# EAGLE design agitator (EAGLE 9.6.2)
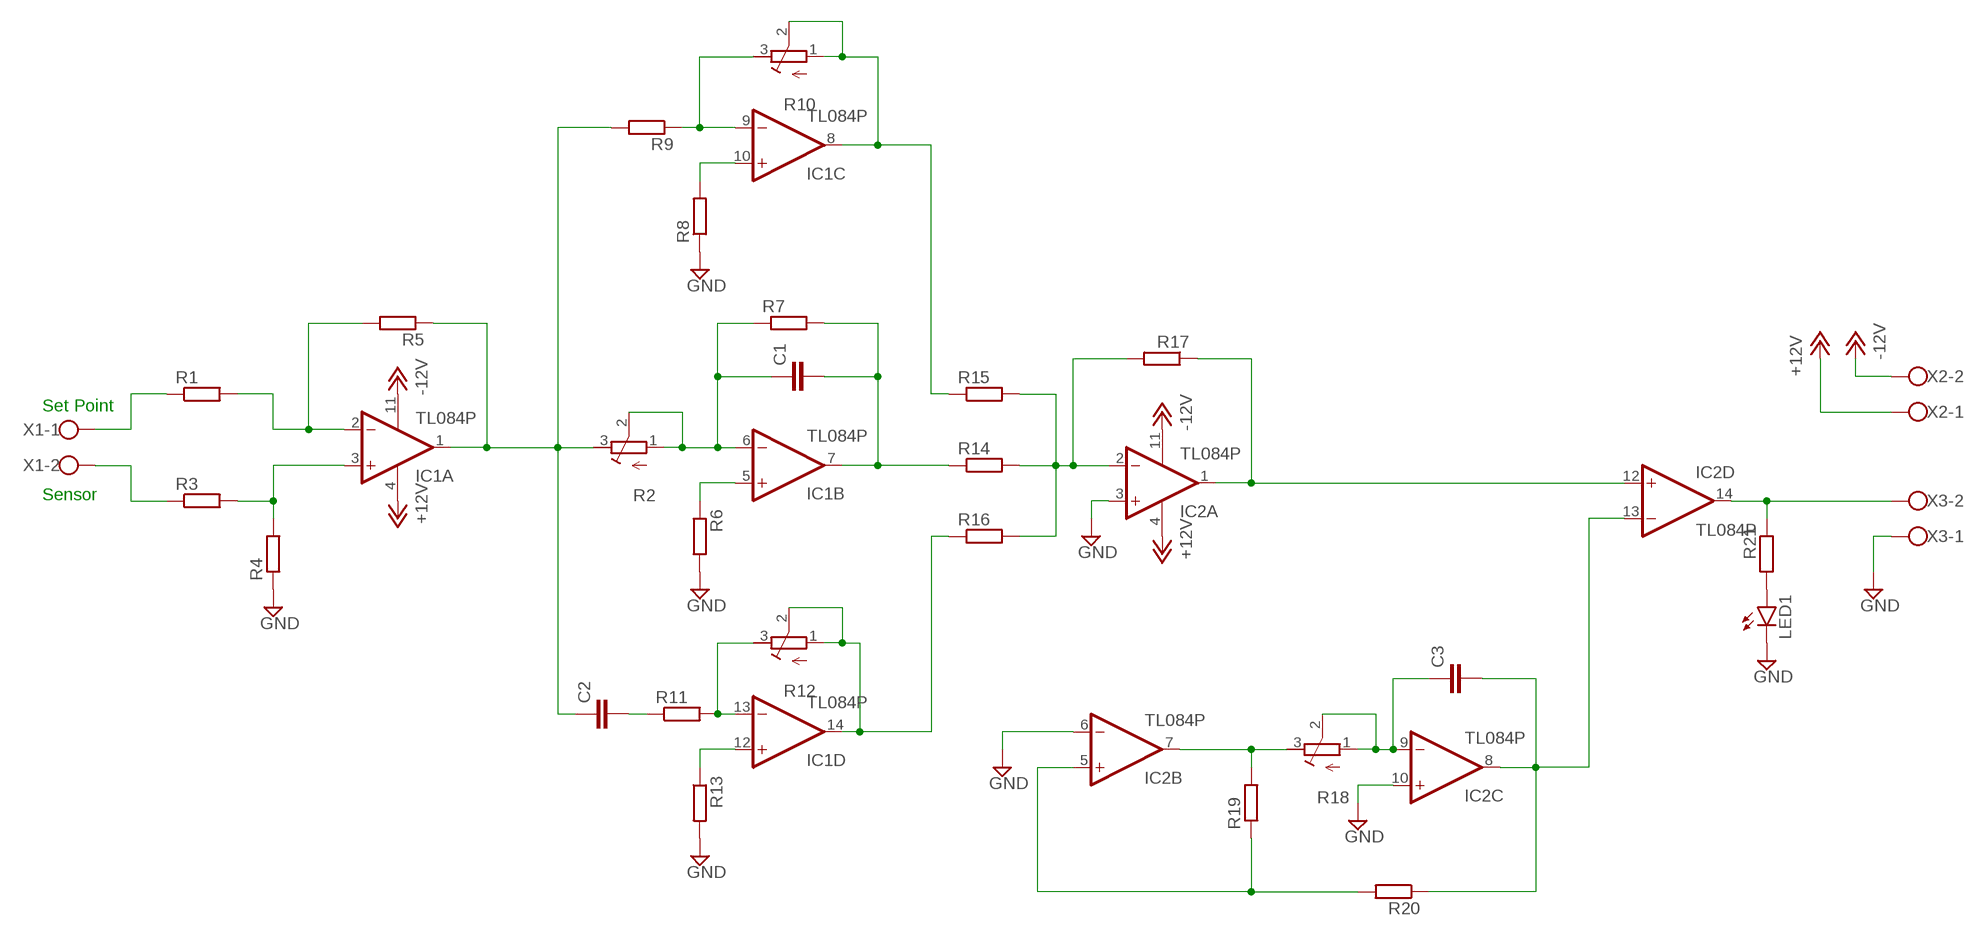
[diagram p0: schematic, sheet 1]

## Parts
C1  C2.5/2  [C2.5-2]
C2  C2.5/2  [C2.5-2]
C3  C2.5/2  [C2.5-2]
IC1  TL084P  [DIL14]
IC2  TL084P  [DIL14]
LED1  LED3MM  [LED3MM]
R1  R-EU_0207/10  [0207/10]
R2  R-TRIMM64W  [RTRIM64W]
R3  R-EU_0207/10  [0207/10]
R4  R-EU_0207/10  [0207/10]
R5  R-EU_0207/10  [0207/10]
R6  R-EU_0207/10  [0207/10]
R7  R-EU_0207/10  [0207/10]
R8  R-EU_0207/10  [0207/10]
R9  R-EU_0207/10  [0207/10]
R10  R-TRIMM64W  [RTRIM64W]
R11  R-EU_0207/10  [0207/10]
R12  R-TRIMM64W  [RTRIM64W]
R13  R-EU_0207/10  [0207/10]
R14  R-EU_0207/10  [0207/10]
R15  R-EU_0207/10  [0207/10]
R16  R-EU_0207/10  [0207/10]
R17  R-EU_0207/10  [0207/10]
R18  R-TRIMM64W  [RTRIM64W]
R19  R-EU_0207/10  [0207/10]
R20  R-EU_0207/10  [0207/10]
R21  R-EU_0207/10  [0207/10]
X1  W237-102  [W237-102]
X2  W237-102  [W237-102]
X3  W237-102  [W237-102]

## Nets
+12V: IC1.4(P:V+) IC2.4(P:V+) X2.1
-12V: IC1.11(P:V-) IC2.11(P:V-) X2.2
GND: IC2.3(A:+IN) IC2.6(B:-IN) IC2.10(C:+IN) LED1.K(C) R4.1 R6.2 R8.1 R13.2 X3.1
N$1: IC1.3(A:+IN) R3.2 R4.2
N$2: IC1.2(A:-IN) R1.2 R5.2
N$3: C2.1 IC1.1(A:OUT) R2.3(E) R5.1 R9.2
N$4: R1.1 X1.1
N$5: R3.1 X1.2
N$6: C1.1 IC1.6(B:-IN) R2.1(A) R2.2(S) R7.1
N$7: C1.2 IC1.7(B:OUT) R7.2 R14.1
N$8: IC1.5(B:+IN) R6.1
N$9: IC1.10(C:+IN) R8.2
N$10: IC1.9(C:-IN) R9.1 R10.3(E)
N$11: C2.2 R11.1
N$12: IC1.8(C:OUT) R10.1(A) R10.2(S) R15.1
N$13: IC1.13(D:-IN) R11.2 R12.3(E)
N$14: IC1.14(D:OUT) R12.1(A) R12.2(S) R16.1
N$15: IC1.12(D:+IN) R13.1
N$16: IC2.2(A:-IN) R14.2 R15.2 R16.2 R17.2
N$17: IC2.1(A:OUT) IC2.12(D:+IN) R17.1
N$18: IC2.7(B:OUT) R18.3(E) R19.2
N$19: C3.1 IC2.9(C:-IN) R18.1(A) R18.2(S)
N$20: LED1.A R21.2
N$21: IC2.5(B:+IN) R19.1 R20.2
N$22: C3.2 IC2.8(C:OUT) IC2.13(D:-IN) R20.1
N$23: IC2.14(D:OUT) R21.1 X3.2

## Notes on the sheet
- Set Point
- Sensor

## Library data of the parts
C1-C3 = capacitor-wima:C: CAPACITOR naming: grid - package width
IC1 IC2 = linear:TL084: OP AMP
LED1 = led:LED: LED OSRAM: - CHIPLED LG R971, LG N971, LY N971, LG Q971, LY Q971, LO R971, LY R971 LH N974, LH R974 LS Q976, LO Q976, LY Q976 LO Q996 - Hyper CHIPLED LW Q18S LB Q993, LB Q99A, LB R99A - SideLED LS A670, LO A670, LY A670, LG A670, LP A670 LB A673, LV A673, LT A673, LW A673 LH A674 LY A675 LS A676, LA A676, LO A676, LY A676, LW A676 LS A679, LY A679, LG A679 - Hyper Micro SIDELED® LS Y876, LA Y876, LO Y876, LY Y876 LT Y87S - SmartLED LW L88C, LW L88S LB L89C, LB L89S, LG L890 LS L89K, LO L89K, LY L89K LS L896, LA L896, LO L896, LY L896 - TOPLED LS T670, LO T670, LY T670, LG T670, LP T670 LSG T670, LSP T670, LSY T670, LOP T670, LYG T670 LG T671, LOG T671, LSG T671 LB T673, LV T673, LT T673, LW T673 LH T674 LS T676, LA T676, LO T676, LY T676, LB T676, LH T676, LSB T676, LW T676 LB T67C, LV T67C, LT T67C, LS T67K, LO T67K, LY T67K, LW E67C LS E67B, LA E67B, LO E67B, LY E67B, LB E67C, LV E67C, LT E67C LW T67C LS T679, LY T679, LG T679 LS T770, LO T770, LY T770, LG T770, LP T770 LB T773, LV T773, LT T773, LW T773 LH T774 LS E675, LA E675, LY E675, LS T675 LS T776, LA T776, LO T776, LY T776, LB T776 LHGB T686 LT T68C, LB T68C - Hyper Mini TOPLED® LB M676 - Mini TOPLED Santana® LG M470 LS M47K, LO M47K, LY M47K Source: http://www.osram.convergy.de LUXEON: - LUMILED® LXK2-PW12-R00, LXK2-PW12-S00, LXK2-PW14-U00, LXK2-PW14-V00 LXK2-PM12-R00, LXK2-PM12-S00, LXK2-PM14-U00 LXK2-PE12-Q00, LXK2-PE12-R00, LXK2-PE12-S00, LXK2-PE14-T00, LXK2-PE14-U00 LXK2-PB12-K00, LXK2-PB12-L00, LXK2-PB12-M00, LXK2-PB14-N00, LXK2-PB14-P00, LXK2-PB14-Q00 LXK2-PR12-L00, LXK2-PR12-M00, LXK2-PR14-Q00, LXK2-PR14-R00 LXK2-PD12-Q00, LXK2-PD12-R00, LXK2-PD12-S00 LXK2-PH12-R00, LXK2-PH12-S00 LXK2-PL12-P00, LXK2-PL12-Q00, LXK2-PL12-R00 Source: www.luxeon.com KINGBRIGHT: KA-3528ASYC Source: www.kingbright.com
R1 R3-R9 R11 R13-R17 R19-R21 = rcl:R-EU_: RESISTOR, European symbol; SPICEPREFIX: R
R2 R10 R12 R18 = rcl:R-TRIMM: Trimm resistor; SPICEMODEL: X; SPICEPREFIXL: POT
X1-X3 = con-wago-500:W237-102: WAGO SCREW CLAMP; MPN: 237-102; OC_FARNELL: unknown; OC_NEWARK: 70K9898

## Board
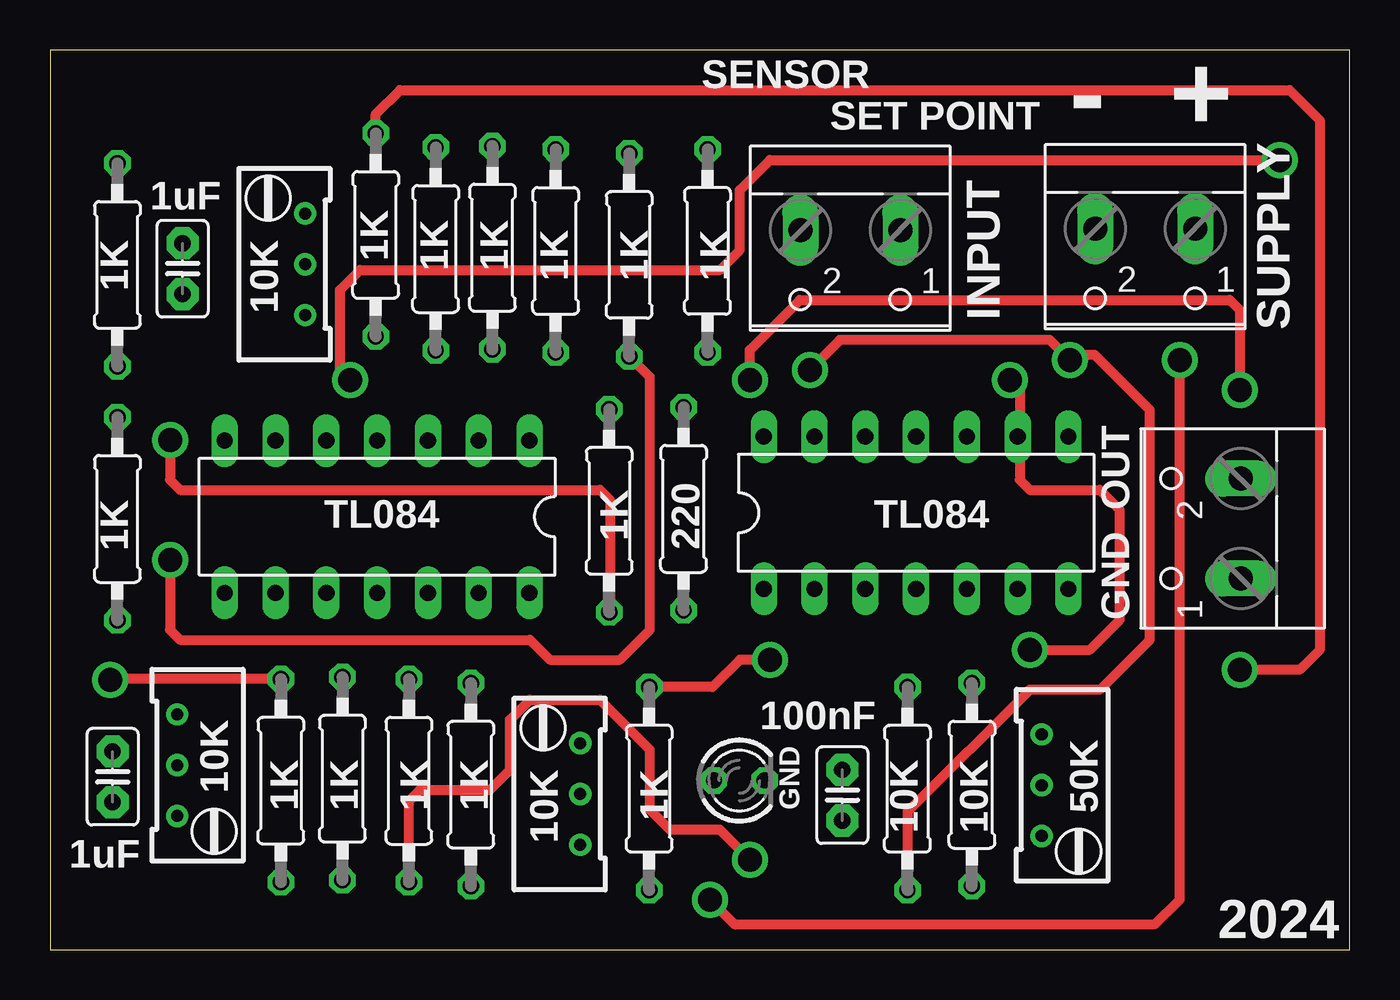
[diagram p1: board, top side]
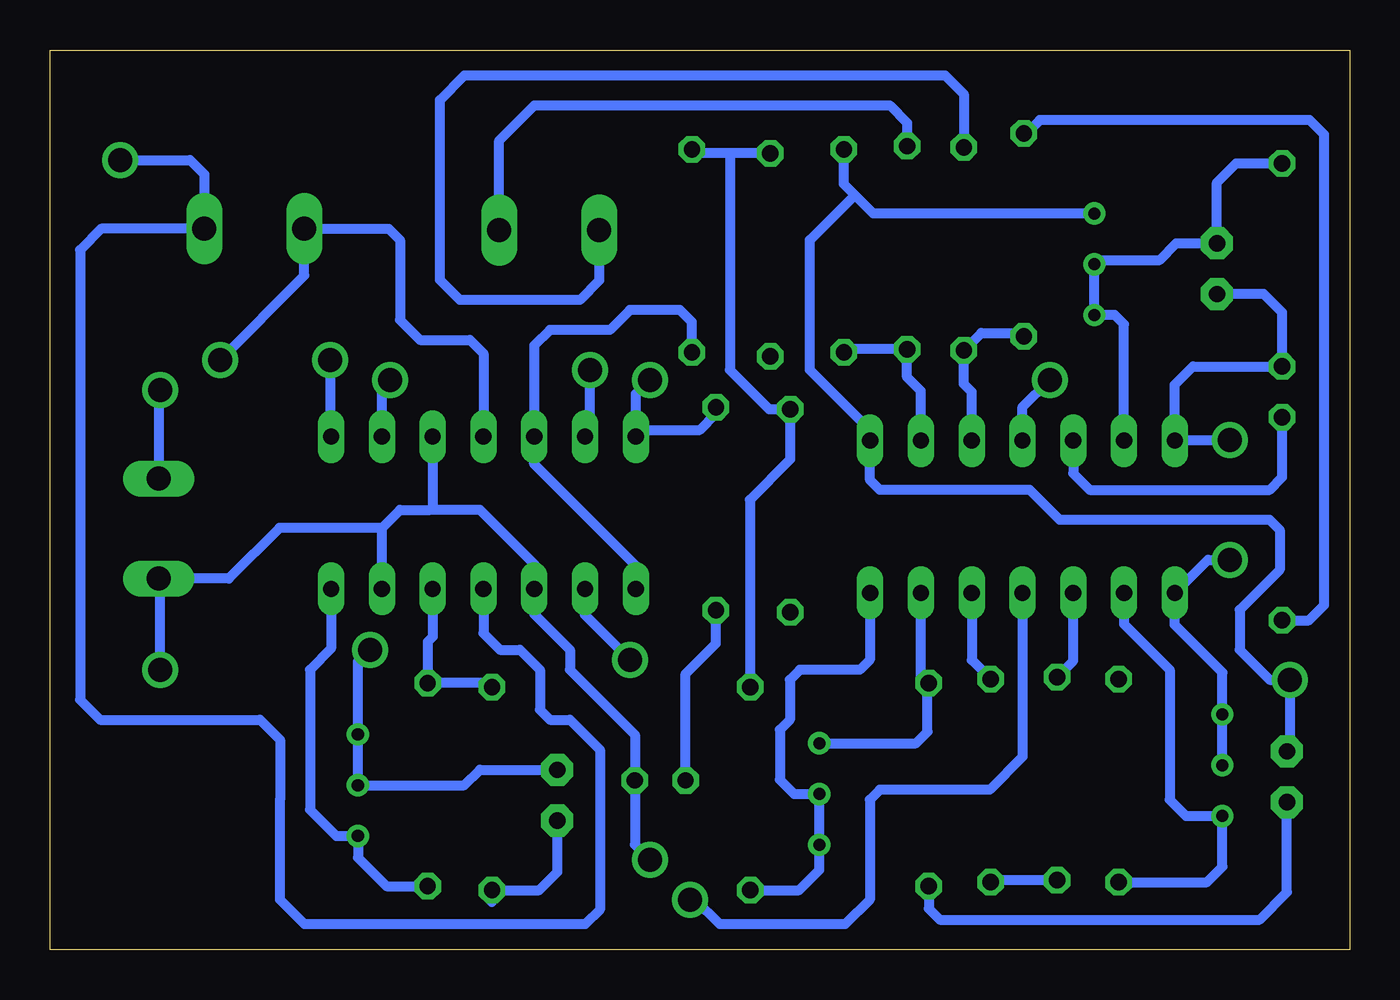
[diagram p2: board, bottom side, seen from below]

Size 65 x 45 mm. Coordinates in mm from the lower left corner, seen from the top.
Outline: 0,0 65,0 65,45 0,45 0,0
Copper layers (1*16): Top 0.035mm / dielectric 1.5mm / Bottom 0.035mm
Design rules "default": minimum track width 6mil, minimum drill 0.35mm, track to track 6mil, track to pad 6mil, pad to pad 6mil, via to via 6mil, smd to smd 6mil, copper to edge 40mil, drill to drill 6mil, minimum pad ring 10mil, minimum via ring 8mil, stop-mask expansion 4mil, vias tented up to drill 0mil, thermal gap 10mil

### Footprints (pad centres in the part's own frame; a part is rotated, then mirrored left to right if it is on the bottom)
C2.5-2 = drill 0.813 pad 1.6 octagon: 1 -1.27,0; 2 1.27,0
DIL14 = drill 0.813 long: 1 -7.62,-3.81; 2 -5.08,-3.81; 3 -2.54,-3.81; 4 0,-3.81; 5 2.54,-3.81; 6 5.08,-3.81; 7 7.62,-3.81; 8 7.62,3.81; 9 5.08,3.81; 10 2.54,3.81; 11 0,3.81; 12 -2.54,3.81; 13 -5.08,3.81; 14 -7.62,3.81
LED3MM = drill 0.813 octagon: A -1.27,0; K 1.27,0
0207/10 = drill 0.813 octagon: 1 -5.08,0; 2 5.08,0
RTRIM64W = drill 0.61: 1 1.27,-2.54; 2 1.27,0; 3 1.27,2.54
W237-102 = drill 1.194 long: 1 -2.5,-1.27; 2 2.5,-1.27

### Placement (x,y rotation side)
C1  6.63,34.06 270 top
C2  3.13,8.64 270 top
C3  39.63,7.72 270 top
IC1  16.36,21.65 180 top
IC2  43.32,21.85 0 top
LED1  34.48,8.46 0 top
R1  22.13,35.11 270 top
R2  11.49,34.28 0 top
R3  19.29,35.05 270 top
R4  16.29,35.75 270 top
R5  25.29,34.95 270 top
R6  3.37,21.55 270 top
R7  3.37,34.25 270 top
R8  14.63,8.55 90 top
R9  11.55,8.45 90 top
R10  7.63,9.22 180 top
R11  21.05,8.25 90 top
R12  25.25,7.78 0 top
R13  17.95,8.45 270 top
R14  27.97,21.95 90 top
R15  28.97,34.75 90 top
R16  29.97,8.05 90 top
R17  32.89,34.95 90 top
R18  50.87,8.22 180 top
R19  46.11,8.25 270 top
R20  42.89,8.05 90 top
R21  31.69,22.05 270 top
X1  40.03,34.72 180 top
X2  54.78,34.79 180 top
X3  58.29,21.06 90 top

### Tracks (layer width: path | path; a pad name or v marks a point on that pad's centre or on a via)
+12V  (via drill 1.2 pad 1.3)
  Top 0.508: v15,28.5 14.5,29 14.5,33 15.5,34 33.5,34 34.5,35 34.5,38 36,39.5 v61.5,39.5
  Bottom 0.508: IC2.4 43.32,15.82 42.5,15 41.5,15 40.5,14 40.5,12 40,11.5 39,11.5 37.5,10 37.5,2 38.23,1.27 52.27,1.27 53.5,2.5 53.5,7 53.5,7.5 53.5,10.5 54.5,11.5 62.5,11.5 63.5,12.5 63.5,35 62.44,36.06 X2.1 57.28,38.78 58,39.5 v61.5,39.5 | IC1.4 16.36,27.14 v15,28.5
-12V  (via drill 1.2 pad 1.3)
  Top 0.508: v33,2.5 34.23,1.27 55.27,1.27 56.5,2.5 v56.5,29.5
  Bottom 0.508: IC2.11 43.32,29.82 44,30.5 46.5,30.5 47.5,31.5 47.5,35.5 48.06,36.06 X2.2 52.28,33.72 v56.5,29.5 | IC1.11 16.36,9.64 18,8 23.5,8 24,7.5 24,2.5 25.23,1.27 31.5,1.27 32.73,2.5 v33,2.5
GND  (via drill 1.2 pad 1.3)
  Top 0.508: R4.1 16.29,41.79 17.5,43 62,43 63.5,41.5 63.5,15 62.5,14 v59.5,14 | R13.2 17.95,7.45 18.5,8 22,8 23,9 23,11.5 24,12.5 27.5,12.5 30,10 30,7 31,6 33.5,6 v35,4.5
  Bottom 0.508: R4.1 16.17,40.83 15.5,41.5 2,41.5 1.27,40.77 1.27,17.23 2.03,16.47 R6.2 | R8.1 17.85,3.47 R13.2 | IC2.6 48.4,21.1 | 46,22 47.5,22 48.4,21.1 | 48.4,21.1 53.52,21.1 56.06,18.56 X3.1 59.56,18.94 59.5,19 v59.5,14 | 46,22 43.5,22 40.78,19.28 IC2.3 40.78,16.78 39,15 39,14 35.75,10.75 LED1.K 35.75,5.25 v35,4.5 | IC2.10 45.86,22.14 46,22
N$1
  Bottom 0.508: R4.2 16.46,30.84 18.42,30.84 R3.2 19.29,28.29 18.9,27.9 IC1.3
N$2
  Bottom 0.508: IC1.2 21.44,27.94 22.13,28.63 R1.2 25.13,30.03 R5.2
N$3  (via drill 1.2 pad 1.3)
  Top 0.508: R9.2 3.03,13.53 v3,13.5
  Bottom 0.508: R2.3 23.82,36.82 24.75,37.75 | R5.1 25.29,38.29 24.75,37.75 | C2.1 3,10.04 v3,13.5 4,13.5 5.5,15 5.5,17 3.5,19 3.5,21 4,21.5 14.5,21.5 16,23 23.5,23 23.98,23.48 IC1.1 23.98,25.98 27,29 27,35.5 24.75,37.75
N$4
  Bottom 0.508: X1.1 42.53,40.47 40.77,42.23 23,42.23 22.13,41.36 R1.1
N$5
  Bottom 0.508: X1.2 37.53,33.47 38.5,32.5 44.5,32.5 45.5,33.5 45.5,42.5 44.27,43.73 20.23,43.73 19.29,42.79 R3.1
N$6
  Bottom 0.508: R7.1 5.67,39.33 6.63,38.37 C1.1 8.67,35.33 9.5,34.5 12.54,34.5 R2.2 R2.1 11.74,31.74 11.28,31.28 IC1.6
N$7  (via drill 1.2 pad 1.3)
  Top 0.508: v6,25.5 6,23.5 6.5,23 27.5,23 28,22.5 28,16.9 R14.1
  Bottom 0.508: C1.2 4.29,32.79 3.37,31.87 R7.2 7.83,29.17 8.74,28.26 IC1.7 8.7,25.5 v6,25.5
N$8
  Bottom 0.508: IC1.5 13.82,23.82 13,23 4,23 3.37,23.63 R6.1
N$9
  Bottom 0.508: R8.2 13.82,14.44 IC1.10
N$10
  Bottom 0.508: IC1.9 11.28,16.28 9,14 9,7.5 8.18,6.68 R10.3 6.36,4.14 7.13,3.37 R9.1
N$11
  Bottom 0.508: R11.1 21.05,2.05 20.5,1.5 4.5,1.5 3.13,2.87 C2.2
N$12  (via drill 1.2 pad 1.3)
  Top 0.508: R15.1 30,28.64 30,16 28.5,14.5 25,14.5 24,15.5 6.5,15.5 6,16 v6,19.5
  Bottom 0.508: IC1.8 8.74,17.74 | R10.2 R10.1 6.36,13.86 8.74,16.24 IC1.8 | IC1.8 7.08,19.5 v6,19.5
N$13
  Bottom 0.508: R11.2 21.11,13.39 | 21.11,13.39 21.44,13.72 IC1.13 | R12.3 21.68,10.32 21.11,10.89 21.11,13.39
N$14
  Bottom 0.508: R16.1 27.53,2.97 26.52,3.98 R12.1 R12.2 27.78,7.78 28.5,8.5 28.5,11 28,11.5 28,13.5 27.5,14 24.5,14 24,14.5 24,17.82 IC1.14
N$15
  Bottom 0.508: IC1.12 18.9,14.48 R13.1
N$16  (via drill 1.2 pad 1.3)
  Top 0.508: v36,14.5 34.5,14.5 33.13,13.13 R16.2
  Bottom 0.508: R15.2 31,39.83 | 31,39.83 32.69,39.83 R17.2 | R16.2 29.97,22.47 30,22.5 27.97,24.53 R14.2 29.03,27.03 31,29 31,39.83 | IC2.2 38.24,16.74 v36,14.5
N$17
  Bottom 0.508: IC2.1 35.7,19.2 40.78,24.28 IC2.12 40.78,30.22 40,31 37,31 36,32 33.5,32 32.89,31.39 R17.1
N$18
  Bottom 0.508: R19.2 48.17,3.17 49.6,4.6 R18.3 50.68,5.68 52,7 52,14 50.94,15.06 IC2.7
N$19  (via drill 1.2 pad 1.3)
  Top 0.508: v49,15 52,15 53.5,16.5 53.5,22 52.5,23 49,23 48.5,23.5 48.5,28 v48,28.5
  Bottom 0.508: v49,15 49.6,14.4 R18.1 R18.2 44.28,8.22 43.5,9 C3.1 | IC2.9 48.4,28.1 v48,28.5
N$20
  Bottom 0.508: LED1.A 33.21,13.79 31.69,15.31 R21.2
N$21
  Bottom 0.508: R20.2 43.09,13.33 R19.1 46.11,15.39 45.86,15.64 IC2.5
N$22  (via drill 1.2 pad 1.3)
  Top 0.508: v51,29.5 50.75,29.75 | 50.75,29.75 50,30.5 39.5,30.5 v38,29 | 50.75,29.75 52.25,29.75 55,27 55,15.5 52.5,13 49,13 42.89,6.89 R20.1
  Bottom 0.508: 42.89,2.38 R20.1 40.53,2.97 39.63,3.87 C3.2 | IC2.13 38,25.9 v38,29 | v51,29.5 51,25.72 IC2.8
N$23  (via drill 1.2 pad 1.3)
  Top 0.508: v35,28.5 35,30 37.5,32.5 59,32.5 59.5,32 v59.5,28
  Bottom 0.508: R21.1 31.69,26.81 32.5,26 35.36,26 IC2.14 35.7,27.8 v35,28.5 | v59.5,28 59.56,27.94 X3.2

### Text on the board
tNames: SENSOR | SET POINT | - | + | 1uF | 1K | 1K | 1K | 1K | 1K | 1K | 1K | 10K | INPUT | SUPPLY | 1K | TL084 | 1K | TL084 | OUT | 220 | GND | 10K | 100nF | 50K | 1K | 1K | 1K | 1K | 10K | 1K | 10K | 10K | GND | 1uF | 2024